# EAGLE design tenere-controller-rev-A (EAGLE 7.3.0)
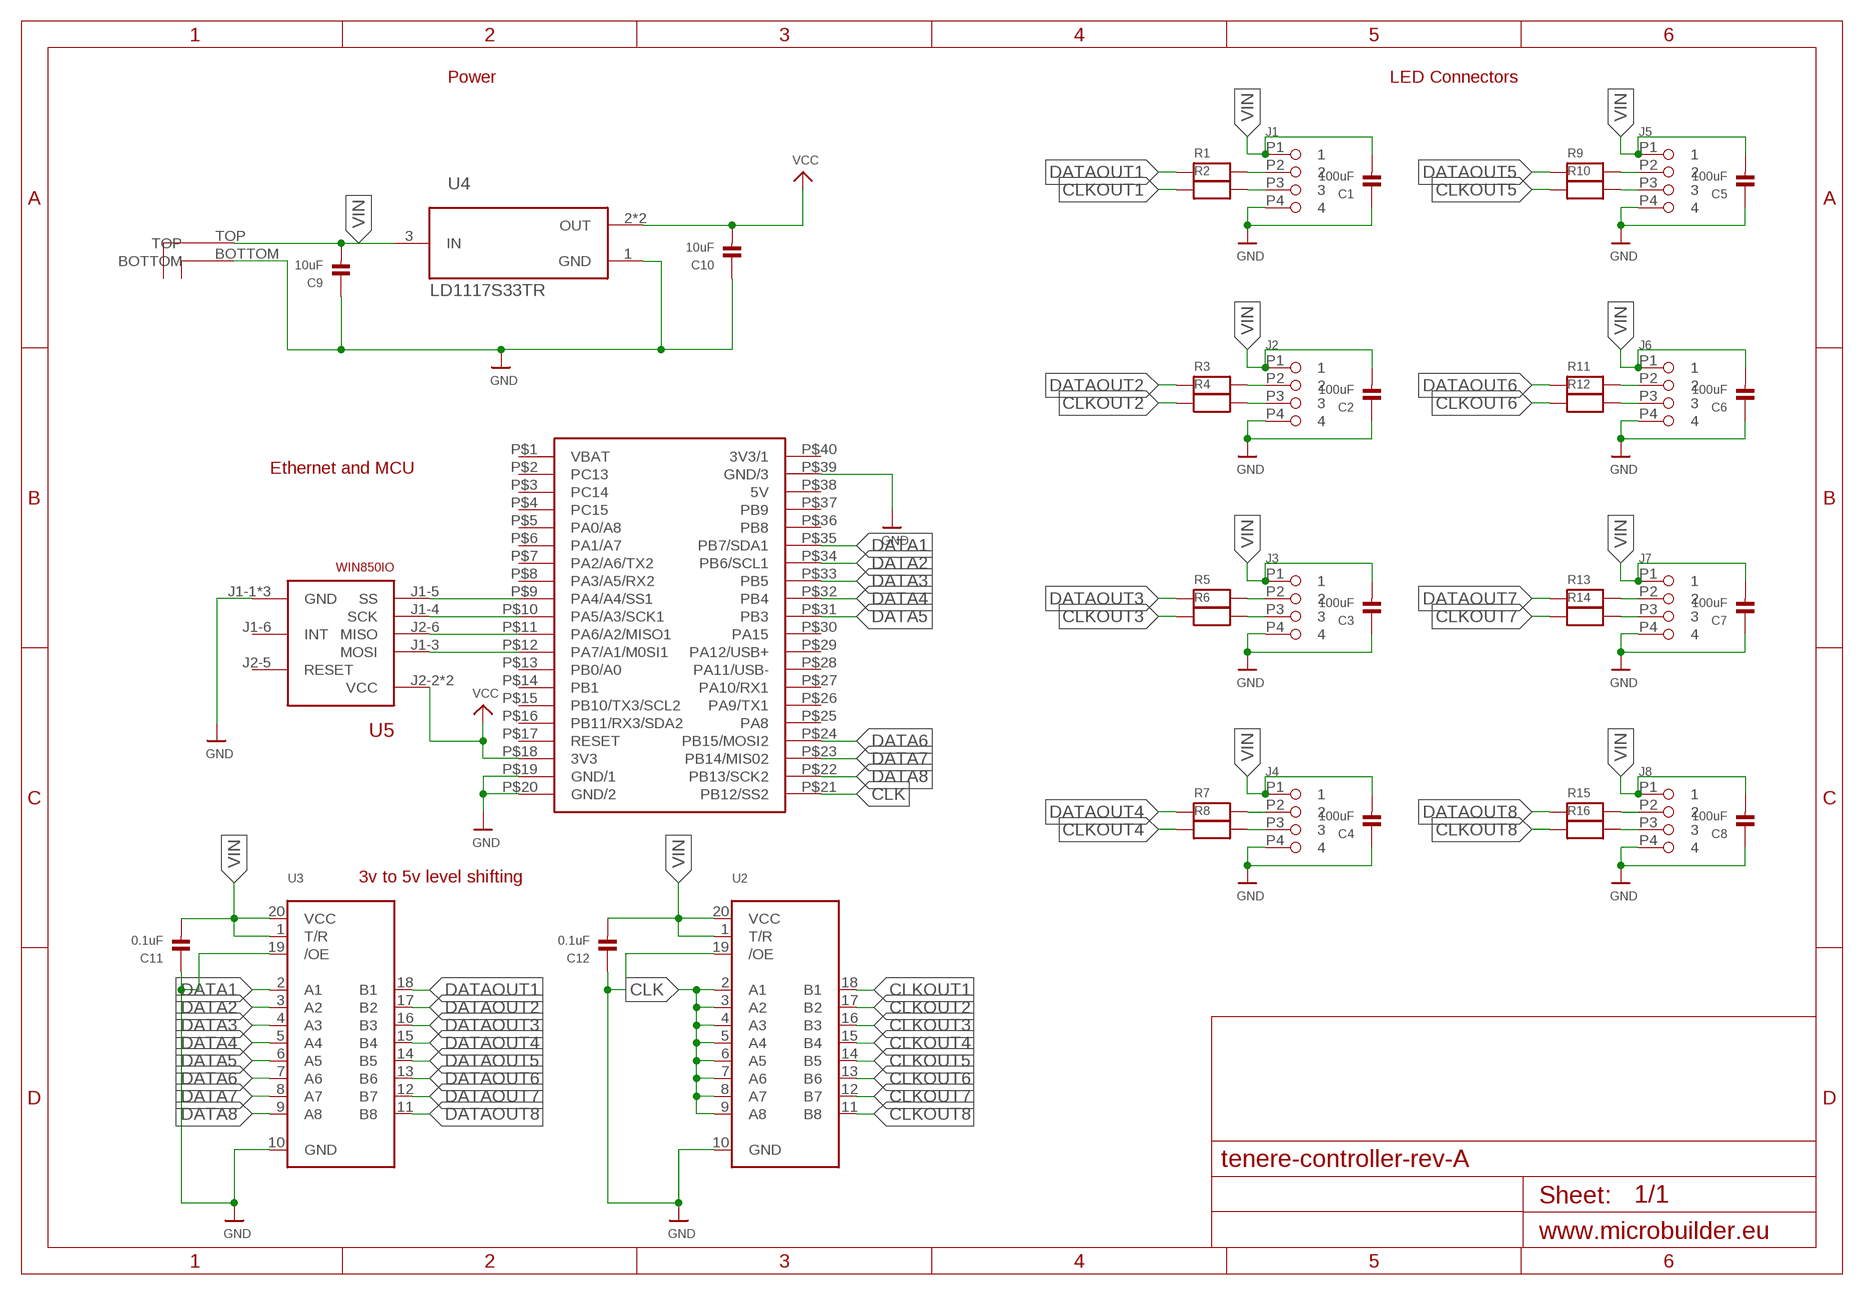
[diagram p0: schematic, sheet 1]

## Parts
C1  100uF  CAP_CERAMIC1206  [1206]
C2  100uF  CAP_CERAMIC1206  [1206]
C3  100uF  CAP_CERAMIC1206  [1206]
C4  100uF  CAP_CERAMIC1206  [1206]
C5  100uF  CAP_CERAMIC1206  [1206]
C6  100uF  CAP_CERAMIC1206  [1206]
C7  100uF  CAP_CERAMIC1206  [1206]
C8  100uF  CAP_CERAMIC1206  [1206]
C9  10uF  CAP_CERAMIC0603  [0603]
C10  10uF  CAP_CERAMIC0603  [0603]
C11  0.1uF  CAP_CERAMIC0603  [0603]
C12  0.1uF  CAP_CERAMIC0603  [0603]
J1  JST-XH-4P-SODE  [JST-XH-BS4P]
J2  JST-XH-4P-SODE  [JST-XH-BS4P]
J3  JST-XH-4P-SODE  [JST-XH-BS4P]
J4  JST-XH-4P-SODE  [JST-XH-BS4P]
J5  JST-XH-4P-SODE  [JST-XH-BS4P]
J6  JST-XH-4P-SODE  [JST-XH-BS4P]
J7  JST-XH-4P-SODE  [JST-XH-BS4P]
J8  JST-XH-4P-SODE  [JST-XH-BS4P]
J9  POWERPOLE-2V  [POWERPOLE_STACKED]
R1  RESISTOR0603  [0603]
R2  RESISTOR0603  [0603]
R3  RESISTOR0603  [0603]
R4  RESISTOR0603  [0603]
R5  RESISTOR0603  [0603]
R6  RESISTOR0603  [0603]
R7  RESISTOR0603  [0603]
R8  RESISTOR0603  [0603]
R9  RESISTOR0603  [0603]
R10  RESISTOR0603  [0603]
R11  RESISTOR0603  [0603]
R12  RESISTOR0603  [0603]
R13  RESISTOR0603  [0603]
R14  RESISTOR0603  [0603]
R15  RESISTOR0603  [0603]
R16  RESISTOR0603  [0603]
U1  BLUEPILL  [40-DIP-BLUE-PIL]
U2  74LCX245  [TSSOP20]
U3  74LCX245  [TSSOP20]
U4  LD1117S33TR  [LD1117S33TR_SOT230P700X180-4N]
U5  WIN850IO  [WIZ850IO]

## Nets
CLK: U1.P$21(PB12/SS2) U2.2(A1) U2.3(A2) U2.4(A3) U2.5(A4) U2.6(A5) U2.7(A6) U2.8(A7) U2.9(A8)
CLKOUT1: R2.1 U2.18(B1)
CLKOUT2: R4.1 U2.17(B2)
CLKOUT3: R6.1 U2.16(B3)
CLKOUT4: R8.1 U2.15(B4)
CLKOUT5: R10.1 U2.14(B5)
CLKOUT6: R12.1 U2.13(B6)
CLKOUT7: R14.1 U2.12(B7)
CLKOUT8: R16.1 U2.11(B8)
DATA1: U1.P$35(PB7/SDA1) U3.2(A1)
DATA2: U1.P$34(PB6/SCL1) U3.3(A2)
DATA3: U1.P$33(PB5) U3.4(A3)
DATA4: U1.P$32(PB4) U3.5(A4)
DATA5: U1.P$31(PB3) U3.6(A5)
DATA6: U1.P$24(PB15/MOSI2) U3.7(A6)
DATA7: U1.P$23(PB14/MIS02) U3.8(A7)
DATA8: U1.P$22(PB13/SCK2) U3.9(A8)
DATAOUT1: R1.1 U3.18(B1)
DATAOUT2: R3.1 U3.17(B2)
DATAOUT3: R5.1 U3.16(B3)
DATAOUT4: R7.1 U3.15(B4)
DATAOUT5: R9.1 U3.14(B5)
DATAOUT6: R11.1 U3.13(B6)
DATAOUT7: R13.1 U3.12(B7)
DATAOUT8: R15.1 U3.11(B8)
GND: C1.1 C2.1 C3.1 C4.1 C5.1 C6.1 C7.1 C8.1 C9.1 C10.1 C11.1 C12.1 J1.P4 J2.P4 J3.P4 J4.P4 J5.P4 J6.P4 J7.P4 J8.P4 J9.BOTTOM U1.P$19(GND/1) U1.P$20(GND/2) U1.P$39(GND/3) U2.10(GND) U2.19(/OE) U3.10(GND) U3.19(/OE) U4.1(GND) U5.J1-1(GND) U5.J1-2(GND) U5.J2-1(GND)
N$1: U1.P$9(PA4/A4/SS1) U5.J1-5(SS)
N$2: U1.P$10(PA5/A3/SCK1) U5.J1-4(SCK)
N$3: U1.P$11(PA6/A2/MISO1) U5.J2-6(MISO)
N$4: U1.P$12(PA7/A1/M0SI1) U5.J1-3(MOSI)
N$5: J1.P2 R1.2
N$6: J1.P3 R2.2
N$7: J2.P2 R3.2
N$8: J2.P3 R4.2
N$9: J3.P2 R5.2
N$10: J3.P3 R6.2
N$11: J4.P2 R7.2
N$12: J4.P3 R8.2
N$13: J5.P2 R9.2
N$14: J5.P3 R10.2
N$15: J6.P2 R11.2
N$16: J6.P3 R12.2
N$17: J7.P2 R13.2
N$18: J7.P3 R14.2
N$19: J8.P2 R15.2
N$20: J8.P3 R16.2
VCC: C10.2 U1.P$18(3V3) U4.2(OUT) U4.4(OUT) U5.J2-2(VCC) U5.J2-3(VCC)
VIN: C1.2 C2.2 C3.2 C4.2 C5.2 C6.2 C7.2 C8.2 C9.2 C11.2 C12.2 J1.P1 J2.P1 J3.P1 J4.P1 J5.P1 J6.P1 J7.P1 J8.P1 J9.TOP U2.1(T/R) U2.20(VCC) U3.1(T/R) U3.20(VCC) U4.3(IN)
Unconnected: U1.P$1(VBAT) U1.P$2(PC13) U1.P$3(PC14) U1.P$4(PC15) U1.P$5(PA0/A8) U1.P$6(PA1/A7) U1.P$7(PA2/A6/TX2) U1.P$8(PA3/A5/RX2) U1.P$13(PB0/A0) U1.P$14(PB1) U1.P$15(PB10/TX3/SCL2) U1.P$16(PB11/RX3/SDA2) U1.P$17(RESET) U1.P$25(PA8) U1.P$26(PA9/TX1) U1.P$27(PA10/RX1) U1.P$28(PA11/USB-) U1.P$29(PA12/USB+) U1.P$30(PA15) U1.P$36(PB8) U1.P$37(PB9) U1.P$38(5V) U1.P$40(3V3/1) U5.J1-6(INT) U5.J2-5(RESET)

## Notes on the sheet
- Power | LED Connectors
- Ethernet and MCU
- 3v to 5v level shifting

## Library data of the parts
C1-C12 = microbuilder:CAP_CERAMIC: Ceramic Capacitors 0402 - 0402 Surface Mount Capacitors 16pF 50V 5% [Digikey: 445-4899-2-ND] 18pF 50V 5% [Digikey: 490-1281-2-ND] 22pF 50V 5% [Digikey: 490-1283-2-ND] 68pF 50V 5% [Digikey: 490-1289-2-ND] 0.1uF 10V 10% [Digikey: 490-1318-2-ND] 1.0uF 6.3V 10% [Digikey: 490-1320-2-ND] 0603 - 0603 Surface Mount Capacitors 16 pF 50V 5% [Digikey: 445-5051-2-ND] 22 pF 50V [Digikey: PCC220ACVTR-ND] 33 pF 50V 5% [Digikey: 490-1415-1-ND] 56pF 50V 5% [Digikey: 490-1421-1-ND] 220pF 50V 5% [Digikey: 445-1285-1-ND] 680 pF 50V 2200 pF 50V 5% C0G [Digikey: 445-1297-1-ND] 5600 pF 100V 5% X7R [Digikey: 478-3711-1-ND] 0.1 µF 25V 10% [Digikey: PCC2277TR-ND] 0.22 µF 16V 10% X7R [Digikey: 445-1318-1-ND] 1.0 µF 25V 10% [Digikey: 445-5146-2-ND] 0603 - RF Specific 3pF 250V +/-0.1pF RF [Digikey: 712-1347-1-ND] 18 pF 250V 5% [Digikey: 478-3505-1-ND or 712-1322-1-ND] 56 pF 250V 5% C0G RF [Digikey: 490-4867-1-ND] 68 pF 250V RF [Digikey: 490-4868-1-ND] 0805 - 0805 Surface Mount Capacitors 220 pF 250V 2% RF Ceramic Capacitor [Digikey: 712-1398-1-ND] 1000 pF 50V 2% NP0 Ceramic Capacitor [Digikey: 478-3760-1-ND] 0.1 µF 25V 10% Ceramic Capacitor [Digikey: PCC1828TR-ND] 1.0 µF 16V 10% Ceramic Capacitor[Digikey: 490-1691-2-ND] 10.0 µF 10V 10% Ceramic Capacitor[Digikey: 709-1228-1-ND] 10.0 uF 16V 10% Ceramic Capacitor [Digikey: 478-5165-2-ND] 47 uF 6.3V 20% Ceramic Capacitor [Digikey: 587-1779-1-ND or 399-5506-1-ND] 1206 - 1206 Surface Mount Capacitors 47uF 10V 20% Ceramic Capacitor [Digikey: 490-5528-1-ND or 399-5508-1-ND or 445-6010-1-ND] 100uF 6.3V -20%, +80% Y5V Ceramic Capacitor (Digikey: 490-4512-1-ND, Mouser: 81-GRM31CF50J107ZE1L)
J1-J8 = Custom:JST-XH-4P-SODE
J9 = Custom:POWERPOLE-2V
R1-R16 = microbuilder:RESISTOR: Resistors 0402 - 0402 Surface Mount Package 22 Ohm 1% 1/16W [Digikey: 311-22.0LRTR-ND] 33 Ohm 5% 1/16W 1.0K 5% 1/16W 1.5K 5% 1/16W 2.0K 1% 1/16W 10.0K 1% 1/16W [Digikey: 311-10.0KLRTR-ND] 10.0K 5% 1/16W [Digikey: RMCF0402JT10K0TR-ND] 12.1K 1% 1/16W [Digikey: 311-22.0LRTR-ND] 100.0K 5% 1/16W 0603 - 0603 Surface Mount Package 0 Ohm 1/10 Watt 1% Resistor 15 Ohm 1/10 Watt 1% Resistor 33 Ohm 1/10 Watt 1% Resistor 49.9 Ohm 1/10 Watt 1% Resistor 100 Ohm 1/10 Watt 1% Resistor 150 Ohm 1/10 Watt 1% Resistor 240 Ohm 1/10 Watt 1% Resistor 390 Ohm 1/10 Watt 1% Resistor 560 Ohm 1/10 Watt 1% Resistor 680 Ohm 1/10 Watt 1% Resistor 750 Ohm 1/10 Watt 1% Resistor 1.0K Ohm 1/10 Watt 1% Resistor 1.5K Ohm 1/10 Watt 1% Resistor 2.0K Ohm 1/10 Watt 1% Resistor 2.2K Ohm 1/10 Watt 1% Resistor 3.3K Ohm 1/10 Watt 1% Resistor 4.7K Ohm 1/10 Watt 1% Resistor 10.0K Ohm 1/10 Watt 1% Resistor 12.0K Ohm 1/10 Watt 1% Resistor 12.1K Ohm 1/10 Watt 1% Resistor 20.0K Ohm 1/10 Watt 1% Resistor 33.0K Ohm 1/10 Watt 1% Resistor 100.0K Ohm 1/10 Watt 1% Resistor 0805 - 0805 Surface Mount Package 0 Ohm 1/8 Watt 1% Resistor 33 Ohm 1/8 Watt 1% Resistor 100 Ohm 1/8 Watt 1% Resistor 150 Ohm 1/8 Watt 1% Resistor 200 Ohm 1/8 Watt 1% Resistor 240 Ohm 1/8 Watt 1% Resistor 330 Ohm 1/8 Watt 1% Resistor 390 Ohm 1/8 Watt 1% Resistor 470 Ohm 1/8 Watt 1% Resistor 1.0K Ohm 1/8 Watt 1% Resistor 1.5K Ohm 1/8 Watt 1% Resistor 2.0K Ohm 1/8 Watt 1% Resistor 4.7K Ohm 1/8 Watt 1% Resistor 5.1K Ohm 1/8 Watt 1% Resistor 5.6K Ohm 1/8 Watt 1% Resistor 10.0K Ohm 1/8 Watt 1% Resistor 22.0K Ohm 1/8 Watt 1% Resistor 33.0K Ohm 1/8 Watt 1% Resistor 100K Ohm 1/8 Watt 1% Resistor 1206 - 1206 Surface Mount Package 2012 - 2010 Surface Mount Package 0.11 Ohm 1/2 Watt 1% Resistor - Digikey: RHM.11UCT-ND
U1 = maplemini:BLUEPILL
U2 U3 = microbuilder:74LCX245: 74LCX245MTC - 5.0V Tolerant Bi-Directional Buffer Can be used to interface 5.0V logic to 2.5 or 3.3V devices Digikey: 74LCX245MTCXTR-ND Mouser: 512-74LCX245MTCX
U4 = Common-Parts-Library-Eagle:LD1117S33TR: LDO Voltage Regulators 3.3V 0.8A Positive; MANUFACTURER: ST Microelectronics
U5 = Custom:WIN850IO

## Board
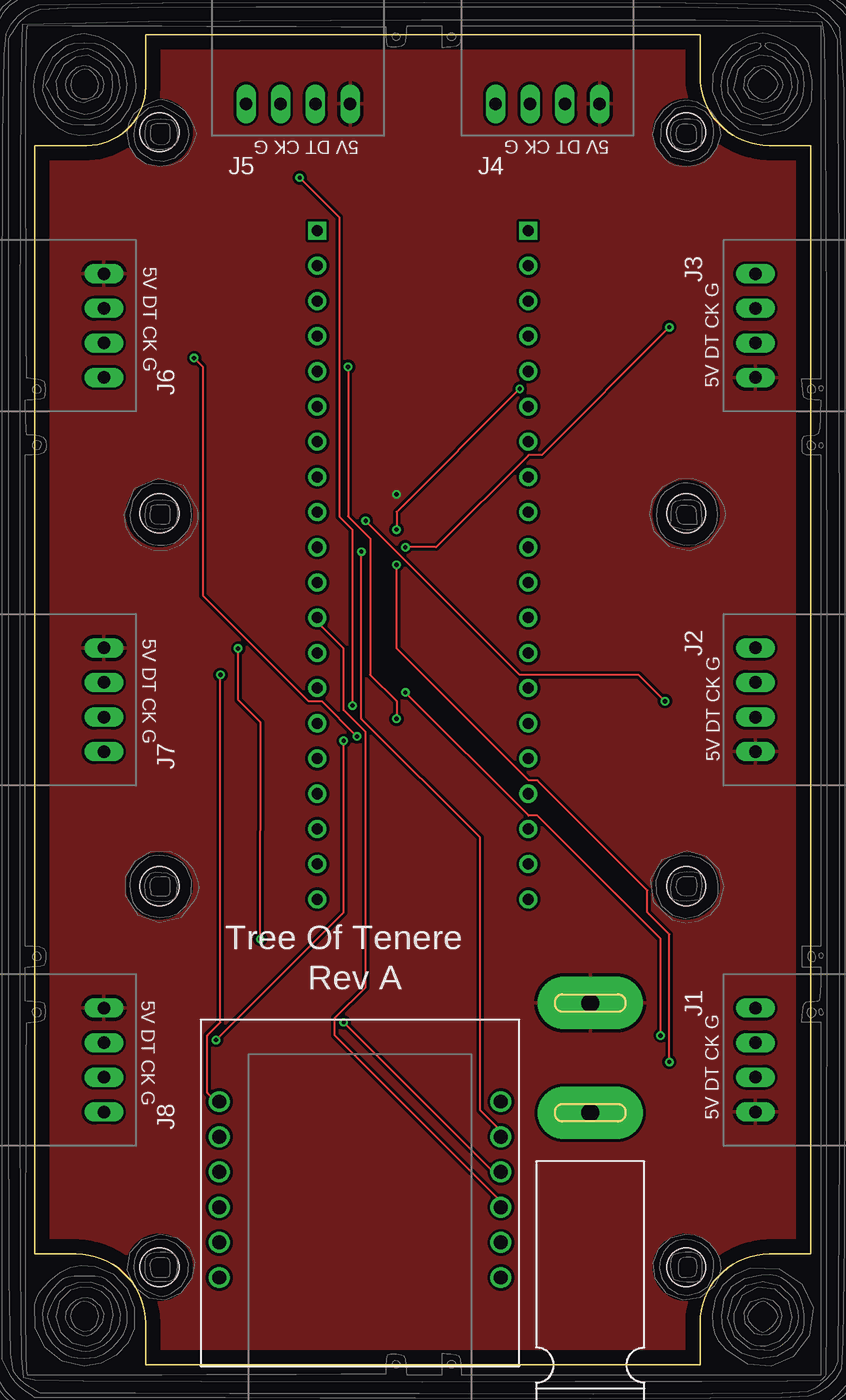
[diagram p1: board, top side]
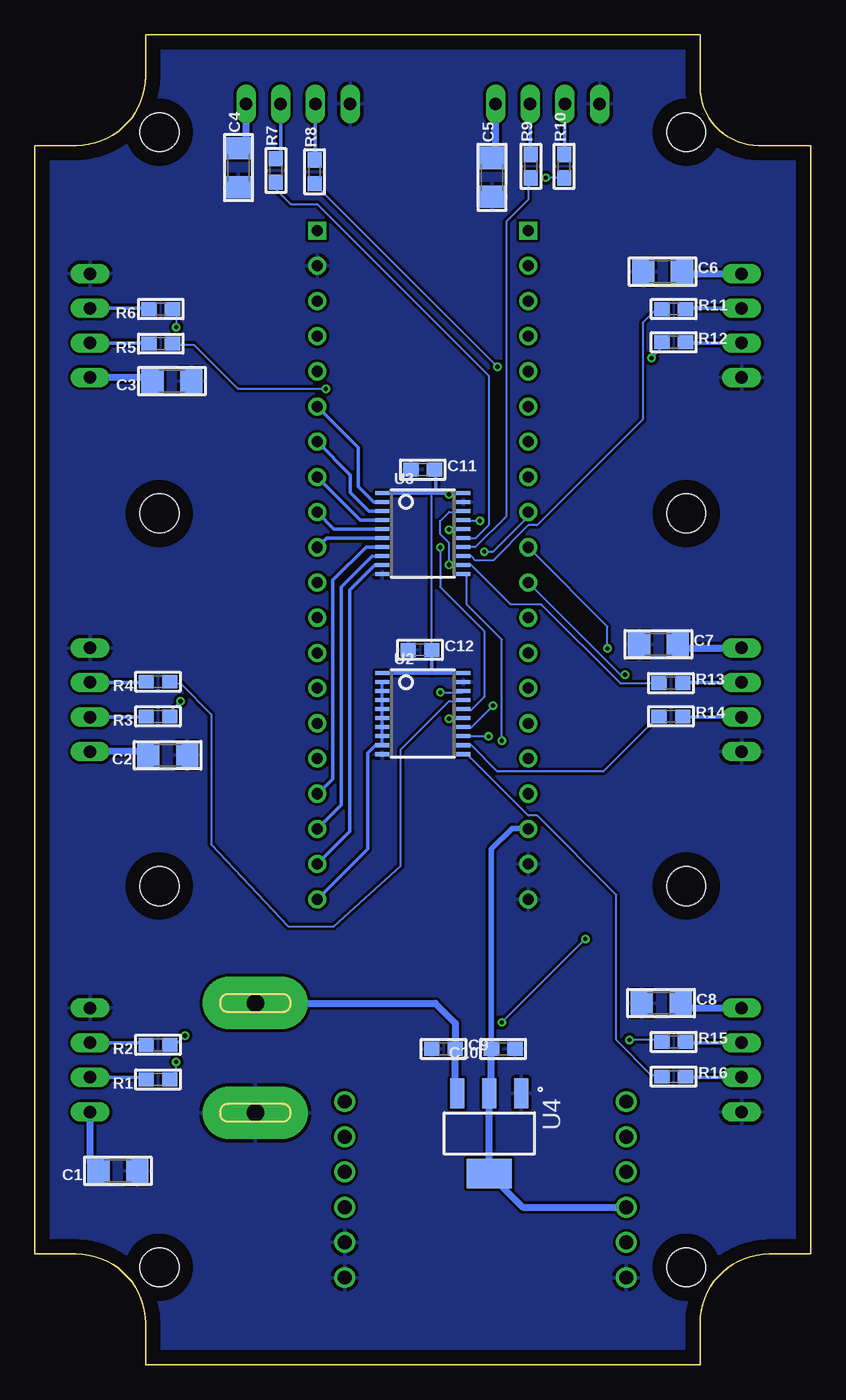
[diagram p2: board, bottom side, seen from below]

Size 56 x 96 mm. Coordinates in mm from the lower left corner, seen from the top.
Outline: 8,96 48,96 48,93 arc90 53,88 56,88 56,8 53,8 arc90 48,3 48,0 8,0 8,3 arc90 3,8 0,8 0,88 3.76,88 arc90 8,92.24 8,96
Copper layers (1*16): Top 0.035mm / dielectric 1.5mm / Bottom 0.035mm
Design rules "SeeedStudio_2layer_DRU_no_angle_20140221 *": minimum track width 6mil, minimum drill 12mil, track to track 8mil, track to pad 8mil, pad to pad 8mil, via to via 8mil, smd to smd 0mil, copper to edge 40mil, drill to drill 10mil, minimum pad ring 10mil, minimum via ring 6mil, stop-mask expansion 2mil, vias tented up to drill 100mil, thermal gap 10mil

### Footprints (pad centres in the part's own frame; a part is rotated, then mirrored left to right if it is on the bottom)
1206 = smd 1.6 x 1.8: 1 -1.4,0; 2 1.4,0
0603 = smd 1.1 x 1: 1 -0.85,0; 2 0.85,0
JST-XH-BS4P = drill 0.9 long: P1 3.75,0; P2 1.25,0; P3 -1.25,0; P4 -3.75,0
POWERPOLE_STACKED = drill 1.27 pad 3.8 long: BOTTOM 0,7.92; TOP 0,0
40-DIP-BLUE-PIL = drill 0.8 square: P$1 -7.62,22.86; P$40 7.62,22.86 | drill 0.8: P$2 -7.62,20.32; P$3 -7.62,17.78; P$4 -7.62,15.24; P$5 -7.62,12.7; P$6 -7.62,10.16; P$7 -7.62,7.62; P$8 -7.62,5.08; P$9 -7.62,2.54; P$10 -7.62,0; P$11 -7.62,-2.54; P$12 -7.62,-5.08; P$13 -7.62,-7.62; P$14 -7.62,-10.16; P$15 -7.62,-12.7; P$16 -7.62,-15.24; P$17 -7.62,-17.78; P$18 -7.62,-20.32; P$19 -7.62,-22.86; P$20 -7.62,-25.4; P$21 7.62,-25.4; P$22 7.62,-22.86; P$23 7.62,-20.32; P$24 7.62,-17.78; P$25 7.62,-15.24; P$26 7.62,-12.7; P$27 7.62,-10.16; P$28 7.62,-7.62; P$29 7.62,-5.08; P$30 7.62,-2.54; P$31 7.62,0; P$32 7.62,2.54; P$33 7.62,5.08; P$34 7.62,7.62; P$35 7.62,10.16; P$36 7.62,12.7; P$37 7.62,15.24; P$38 7.62,17.78; P$39 7.62,20.32
TSSOP20 = smd 0.305 x 0.991: 1 -2.925,-2.918; 2 -2.275,-2.918; 3 -1.625,-2.918; 4 -0.975,-2.918; 5 -0.325,-2.918; 6 0.325,-2.918; 7 0.975,-2.918; 8 1.625,-2.918; 9 2.275,-2.918; 10 2.925,-2.918; 11 2.925,2.918; 12 2.275,2.918; 13 1.625,2.918; 14 0.975,2.918; 15 0.325,2.918; 16 -0.325,2.918; 17 -0.975,2.918; 18 -1.625,2.918; 19 -2.275,2.918; 20 -2.925,2.918
LD1117S33TR_SOT230P700X180-4N = smd 2.15 x 1: 1 -2.9,2.3; 2 -2.9,0; 3 -2.9,-2.3 | smd 2.15 x 3.25: 4 2.9,0
WIZ850IO = drill 1: J1-1 -10.16,18.6; J1-2 -10.16,16.06; J1-3 -10.16,13.52; J1-4 -10.16,10.98; J1-5 -10.16,8.44; J1-6 -10.16,5.9; J2-1 10.16,18.6; J2-2 10.16,16.06; J2-3 10.16,13.52; J2-4 10.16,10.98; J2-5 10.16,8.44; J2-6 10.16,5.9
105*65 = hole 2.8: -40.95,19; -13.45,19; 13.45,19; 40.95,19; -40.95,-19; -13.45,-19; 13.45,-19; 40.95,-19

### Placement (x,y rotation side)
C1  50,14 180 bottom
C2  46.4,44 180 bottom
C3  46.1,71 180 bottom
C4  41.3,86.4 90 bottom
C5  23,85.7 90 bottom
C6  10.7,78.9 0 bottom
C7  11,52 0 bottom
C8  10.8,26.1 0 bottom
C9  26.5,22.8 0 bottom
C10  22.2,22.8 180 bottom
C11  28,64.6 0 bottom
C12  28.2,51.6 0 bottom
J1  52,22 270 top
J2  52,48 270 top
J3  52,75 270 top
J4  37,91 0 top
J5  19,91 0 top
J6  5,75 90 top
J7  5,48 90 top
J8  5,22 90 top
J9  40.08,26.11 180 top
R1  47.1,20.6 180 bottom
R2  47.1,23.1 180 bottom
R3  47.1,46.8 180 bottom
R4  47.1,49.3 180 bottom
R5  46.9,73.7 180 bottom
R6  46.9,76.2 180 bottom
R7  38.6,86.2 90 bottom
R8  35.8,86.1 90 bottom
R9  20.2,86.5 90 bottom
R10  17.8,86.5 90 bottom
R11  9.9,76.2 0 bottom
R12  9.9,73.8 0 bottom
R13  10.1,49.2 0 bottom
R14  10.1,46.8 0 bottom
R15  9.9,23.3 0 bottom
R16  9.9,20.8 0 bottom
U1  28,59 0 top
U2  28,47 270 bottom
U3  28,60 270 bottom
U4  23.2,16.7 270 bottom
U5  23.48,24.9 180 top
U$15  [105*65]  28,48 90 top

### Tracks (layer width: path | path; a pad name or v marks a point on that pad's centre or on a via)
CLK
  Bottom 0.203: U2.9 U2.8 U2.7 30.92,46.27 | 30.92,46.27 U2.6 | U2.2 U2.3 U2.4 U2.5 U2.6 | 30.92,46.27 30.94,46.3 30.98,46.3 30.92,46.36 U2.6
  Bottom 0.254: U1.P$21 31.97,37.25 31.97,44.16 31.41,44.73 U2.9
CLKOUT1  (via drill 0.3)
  Top 0.152: v26.74,48.53 35.63,39.64 36.27,39.64 45.15,30.75 v45.15,23.77
  Bottom 0.152: v26.74,48.53 25.15,48.53 U2.18 | v45.15,23.77 46.11,22.81 R2.1
CLKOUT2
  Bottom 0.152: U2.17 25.15,47.9 26.11,47.9 29.6,44.4 29.6,36.01 34.42,31.64 37.7,31.64 43.27,37.57 43.25,46.94 45.47,49.17 46.11,49.17 R4.1
CLKOUT3  (via drill 0.3)
  Top 0.152: v26.74,59.01 28.96,59.01 35.63,65.67 36.58,65.67 v45.79,74.88
  Bottom 0.152: v26.74,59.01 26.74,56.15 23.57,52.98 23.57,48.21 24.52,47.26 24.84,47.26 U2.16 | v45.79,74.88 45.79,76.15 R6.1
CLKOUT4  (via drill 0.3)
  Top 0.152: v26.11,46.62 26.11,47.9 24.2,49.8 24.2,59.64 22.61,61.23 v22.61,72.03
  Bottom 0.152: v26.11,46.62 25.15,46.62 U2.15 | v22.61,72.03 35.63,85.04 R8.1
CLKOUT5  (via drill 0.3)
  Top 0.152: v22.93,47.58 22.93,60.28 21.98,61.23 21.98,82.82 v19.12,85.68
  Bottom 0.152: v22.93,47.58 24.52,45.99 24.84,45.99 U2.14 | v19.12,85.68 17.85,85.68 R10.1
CLKOUT6  (via drill 0.3)
  Top 0.152: v23.25,45.36 20.71,47.9 19.75,47.9 12.14,55.52 12.14,72.03 v11.5,72.66
  Bottom 0.152: v23.25,45.36 24.84,45.36 U2.13 | v11.5,72.66 10.55,73.61 R12.1
CLKOUT7
  Bottom 0.152: U2.12 24.84,44.72 24.52,44.72 22.61,42.82 14.99,42.82 11.18,46.62 R14.1
CLKOUT8
  Bottom 0.152: U2.11 24.84,44.09 20.39,39.64 19.75,39.64 14.04,33.93 14.04,23.45 11.5,20.91 10.86,20.91 R16.1
DATA1
  Bottom 0.203: 31.54,62.28 U3.2
  Bottom 0.254: U1.P$35 32.66,66.2 32.66,63.39 31.54,62.28
DATA2
  Bottom 0.254: U1.P$34 33.22,64.22 33.22,62.96 31.89,61.62 U3.3
DATA3
  Bottom 0.254: U1.P$33 32.52,60.98 U3.4
DATA4
  Bottom 0.254: U1.P$32 34.4,60.33 U3.5
DATA5
  Bottom 0.254: U1.P$31 34.95,59.67 U3.6
DATA6
  Bottom 0.254: U1.P$24 35.55,41.22 34.49,42.28 34.49,56.62 32.09,59.03 U3.7
DATA7
  Bottom 0.203: 31.63,58.38 U3.8
  Bottom 0.254: U1.P$23 33.88,40.42 33.88,56.12 31.63,58.38
DATA8
  Bottom 0.203: 31.46,57.73 U3.9
  Bottom 0.254: U1.P$22 33.27,38.49 33.27,55.92 31.46,57.73
DATAOUT1  (via drill 0.3)
  Top 0.152: v26.11,57.74 26.11,51.71 35.63,42.18 36.27,42.18 44.2,34.24 44.2,32.66 45.79,31.07 v45.79,21.86
  Bottom 0.152: v26.11,57.74 26.11,59.33 26.74,59.96 26.74,60.91 26.11,61.55 25.15,61.55 U3.18 | v45.79,21.86 45.79,20.91 46.11,20.59 R1.1
DATAOUT2  (via drill 0.3)
  Top 0.152: v23.88,60.91 34.99,49.8 43.57,49.8 v45.47,47.9
  Bottom 0.152: v23.88,60.91 24.84,60.91 U3.17 | v45.47,47.9 46.42,46.94 R3.1
DATAOUT3  (via drill 0.3)
  Top 0.152: v26.11,60.28 26.11,61.55 v34.99,70.44
  Bottom 0.152: v26.11,60.28 25.15,60.28 U3.16 | v34.99,70.44 41.34,70.44 44.52,73.61 45.79,73.61 R5.1
DATAOUT4
  Bottom 0.152: U3.15 24.84,59.64 24.2,59.64 23.25,60.59 23.25,71.39 35.63,83.77 37.53,83.77 38.8,85.04 R7.1
DATAOUT5
  Bottom 0.152: U3.14 24.84,59.01 24.2,59.01 21.98,61.23 21.98,82.5 20.39,84.09 20.39,85.36 R9.1
DATAOUT6
  Bottom 0.152: U3.13 24.84,58.37 24.52,58.37 24.2,58.05 22.93,58.05 20.39,60.59 19.75,60.59 12.14,68.22 12.14,75.2 10.86,76.47 R11.1
DATAOUT7
  Bottom 0.152: U3.12 24.84,57.74 24.52,57.74 21.66,54.88 19.44,54.88 13.72,49.17 11.18,49.17 R13.1
DATAOUT8  (via drill 0.3)
  Top 0.152: v22.3,45.04 22.3,32.66 v13.09,23.45
  Bottom 0.152: v22.3,45.04 22.3,52.34 24.84,54.88 24.84,57.1 U3.11 | v13.09,23.45 10.86,23.45 R15.1
GND
  pour Bottom: -1,97 57,97 57,-1 -1,-1
N$1  (via drill 0.3)
  Top 0.152: v23.57,58.69 23.57,46.62 32.14,38.05 32.14,18.37 33.41,17.1 33.41,16.46 U5.J1-5
  Bottom 0.152: v23.57,58.69 22.93,58.69 20.39,61.23 U1.P$9
N$2  (via drill 0.3)
  Top 0.152: v16.28,30.74 16.3,46.37 14.68,48 v14.68,51.71 | v22.3,24.72 33.41,13.61 U5.J1-4
  Bottom 0.152: v14.68,51.71 14.68,53.29 20.07,58.69 U1.P$10 | v22.3,24.72 v16.28,30.74
N$3  (via drill 0.3)
  Top 0.152: v13.41,49.8 13.41,24.72 12.45,23.77 12.45,19.64 13.09,19 U5.J2-6
  Bottom 0.152: v13.41,49.8 13.72,49.8 20.07,56.15 U1.P$11
N$4
  Top 0.152: U1.P$12 20.39,53.61 22.3,51.71 22.3,47.26 23.88,45.67 23.88,27.26 21.66,25.04 21.66,23.77 33.41,12.02 33.41,11.38 U5.J1-3
N$5
  Bottom 0.203: R1.2 48.1,20.75
  Bottom 0.254: 48.1,20.75 J1.P2
N$6
  Bottom 0.203: R2.2 48.1,23.25
  Bottom 0.254: 48.1,23.25 J1.P3
N$7
  Bottom 0.203: R3.2 48,46.75
  Bottom 0.254: 48,46.75 J2.P2
N$8
  Bottom 0.203: R4.2 48,49.25
  Bottom 0.254: 48,49.25 J2.P3
N$9
  Bottom 0.203: R5.2 47.8,73.75
  Bottom 0.254: 47.8,73.75 J3.P2
N$10
  Bottom 0.203: R6.2 47.8,76.25
  Bottom 0.254: 47.8,76.25 J3.P3
N$11
  Bottom 0.203: R7.2 38.25,87.4
  Bottom 0.254: 38.25,87.4 J4.P2
N$12
  Bottom 0.203: R8.2 35.75,87
  Bottom 0.254: 35.75,87 J4.P3
N$13
  Bottom 0.203: R9.2 20.25,87.4
  Bottom 0.254: 20.25,87.4 J5.P2
N$14
  Bottom 0.203: R10.2 17.75,87.4
  Bottom 0.254: 17.75,87.4 J5.P3
N$15
  Bottom 0.203: R11.2 9,76.25
  Bottom 0.254: 9,76.25 J6.P2
N$16
  Bottom 0.203: R12.2 9,73.75
  Bottom 0.254: 9,73.75 J6.P3
N$17
  Bottom 0.203: R13.2 9.2,49.25
  Bottom 0.254: 9.2,49.25 J7.P2
N$18
  Bottom 0.203: R14.2 9.2,46.75
  Bottom 0.254: 9.2,46.75 J7.P3
N$19
  Bottom 0.203: R15.2 9,23.25
  Bottom 0.254: 9,23.25 J8.P2
N$20
  Bottom 0.203: R16.2 9,20.75
  Bottom 0.254: 9,20.75 J8.P3
VCC
  Bottom 0.381: C10.2 23.05,37.23 21.56,38.73 20.43,38.73 U1.P$18
  Bottom 0.508: U5.J2-3 20.78,11.38 U4.4 U4.2 23.05,19.75 C10.2
VIN  (via drill 0.3)
  Bottom 0.152: 27.38,62.92 27.38,51.71 C12.2 | v26.11,62.82 26.11,62.92
  Bottom 0.254: U3.20 26.11,62.92 27.07,62.92 | 27.07,62.92 27.38,62.92 U3.1 | C11.2 27.07,64.6 27.07,62.92 | U2.20 27.35,49.93 | 27.35,49.93 U2.1 | C12.2 | C12.2 27.35,49.93
  Bottom 0.508: C1.2 52,14.6 J1.P1 | C2.2 48.05,44.25 J2.P1 | C8.2 9.05,25.75 J8.P1 | C7.2 9.35,51.75 J7.P1 | C6.2 9.15,78.75 J6.P1 | C5.2 22.75,87.35 J5.P1 | C4.2 40.75,88.35 J4.P1 | C3.2 47.75,71.25 J3.P1 | U4.3 25.65,19.75 C9.2 25.65,24.66 27.1,26.1 40.07,26.1 J9.TOP
  pour Top: -1,97 57,97 57,-1 -1,-1

### Text on the board
tPlace: 5V DT CK G | 5V DT CK G | 5V DT CK G | 5V DT CK G | 5V DT CK G | 5V DT CK G | Tree Of Tenere | Rev A | 5V DT CK G | 5V DT CK G